# Altium schematic sheet Main.SchDoc: Earpiece mainboard
size A; DocumentNumber: 1; SheetNumber: 1; SheetTotal: 1
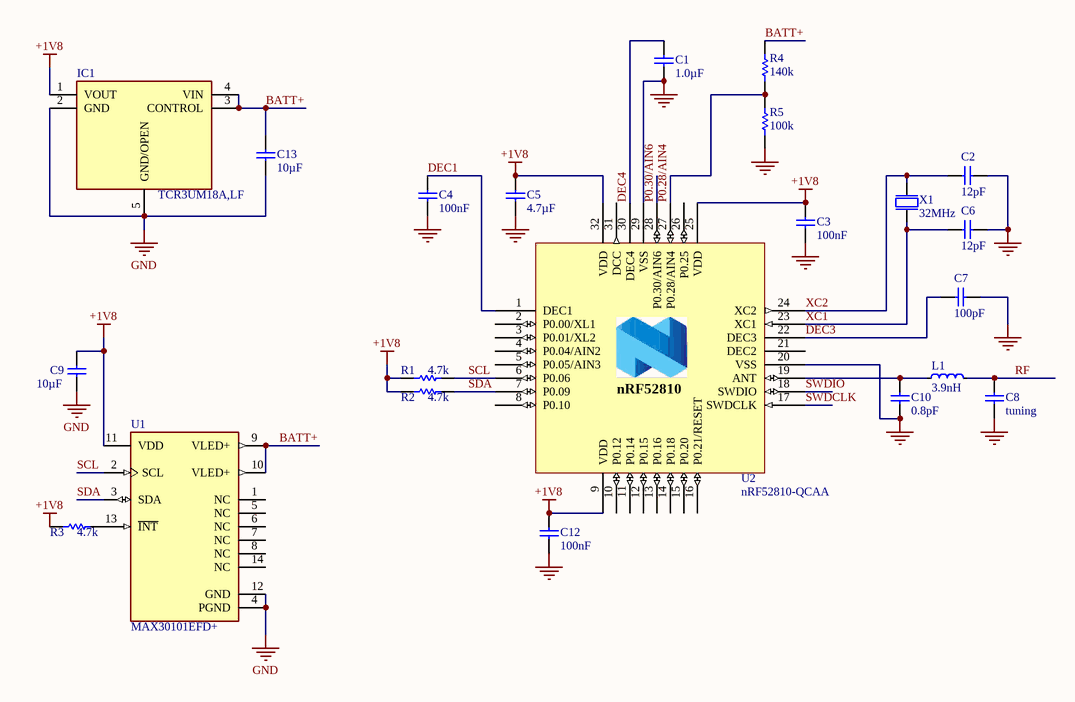
[diagram p0: Main.SchDoc]

## Parts
C1  1.0µF  [CAPC1005X04L]
C2  12pF  [CAPC1005X04L]
C3  100nF  [CAPC1005X04L]
C4  100nF  [CAPC1005X04L]
C5  4.7µF  [CAPC1005X04L]
C6  12pF  [CAPC1005X04L]
C7  100pF  [CAPC1005X04L]
C8  tuning  [CAPC1608X06L]
C9  10µF  [CAPC1005X04L]
C10  0.8pF  [CAPC1005X04L]
C12  100nF  [CAPC1005X04L]
C13  10µF  [CAPC1005X04L]
IC1  TCR3UM18A,LF  [TCR3UM18ALF]
L1  3.9nH  [INDC1005X04L]
R1  4.7k  [RESC0603X28X15NL05T05]
R2  4.7k  [RESC0603X28X15NL05T05]
R3  4.7k  [RESC0603X28X15NL05T05]
R4  140k  [RESC0603X28X15NL05T05]
R5  100k  [RESC0603X28X15NL05T05]
U1  MAX30101EFD+  [FP-F143A5-1-MFG]
U2  nRF52810-QCAA  [Nordic_QFN50P500X500X90-33N]
X1  32MHz  [BT-XTAL_2016]

## Nets
+1V8: C3.1 C5.1 C9.1 C12.1 IC1.1(VOUT) R1.1 R2.2 R3.2 U1.11(VDD) U2.9(VDD) U2.25(VDD) U2.32(VDD)
GND: C1.1 C2.2 C3.2 C4.2 C5.2 C6.2 C7.2 C8.1 C9.2 C10.1 C12.2 C13.1 IC1.2(GND) IC1.5(GND/OPEN) R5.2 U1.4(PGND) U1.12(GND) U2.20(VSS) U2.29(VSS) U2.33 X1.2(GND) X1.4(GND)
BATT+: C13.2 IC1.3(CONTROL) IC1.4(VIN) R4.1 U1.9(VLED+) U1.10(VLED+)
DEC1: C4.1 U2.1(DEC1)
DEC3: C7.1 U2.22(DEC3)
DEC4: C1.2 U2.30(DEC4)
P0.28/AIN4: R4.2 R5.1 U2.27(P0.28/AIN4)
P0.30/AIN6: U2.28(P0.30/AIN6)
RF: C8.2 L1.2
SCL: R1.2 U1.2(SCL) U2.6(P0.06)
SDA: R2.1 U1.3(SDA) U2.7(P0.09)
SWDCLK: U2.17(SWDCLK)
SWDIO: U2.18(SWDIO)
XC1: C6.1 U2.23(XC1) X1.1(inp)
XC2: C2.1 U2.24(XC2) X1.3(out)
NetC10_2: C10.2 L1.1 U2.19(ANT)
NetR3_1: R3.1 U1.13(~{INT})

Not connected (* = marked no-connect by the designer): U1 1(NC) 5(NC) 6(NC) 7(NC) 8(NC) 14(NC); U2 2(P0.00/XL1) 3(P0.01/XL2) 4(P0.04/AIN2) 5(P0.05/AIN3) 8(P0.10) 10(P0.12) 11(P0.14) 12(P0.15) 13(P0.16) 14(P0.18) 15(P0.20) 16(P0.21/RESET) 21(DEC2) 26(P0.25) 31(DCC)

## Notes on the sheet
- (in symbol nRF52810-QCAA) nRF52810

## Library data of the parts
C1 C9 C13 = C0603-1µ0: Capacitor, X7R, ±10%; Note: 16V; Part Number: C0603-1µ0; LatestRevisionDate: 2013-06-05; Pin Count: 2; Publisher: Nordic Semiconductor; Published: 2009-05-08; Footprint Doc: 0603; Manufacturer: *; Manufacturer Part Number: *
  C1: Value: 1.0µF
  C9 C13: Value: 10µF
C2 C6 = C0402-12p: Capacitor, NP0, ±2%; Note: 50V; Part Number: C0402-12p; LatestRevisionDate: 2011-05-11; Pin Count: 2; Publisher: Nordic Semiconductor; Published: 2009-05-08; Value: 12pF; Footprint Doc: 0402; Manufacturer: *; Manufacturer Part Number: *
C3 C4 C12 = C0402-100n: Capacitor, X7R, ±10%; Note: 16V; Part Number: C0402-100n; LatestRevisionDate: 2009-11-23; Pin Count: 2; Publisher: Nordic Semiconductor; Published: 2009-05-08; Value: 100nF; Footprint Doc: 0402; Manufacturer: *; Manufacturer Part Number: *
C5 = C0603-4µ7: Capacitor, X5R, ±10%; Note: 6.3V; Part Number: C0603-4µ7; LatestRevisionDate: 2009-11-23; Pin Count: 2; Publisher: Nordic Semiconductor; Published: 2009-05-08; Value: 4.7µF; Footprint Doc: 0603; Manufacturer: *; Manufacturer Part Number: *
C7 = C0402-100p: Capacitor, NP0, ±5%; Note: 50V; Part Number: C0402-100p; LatestRevisionDate: 2009-05-08; Pin Count: 2; Publisher: Nordic Semiconductor; Published: 2009-05-08; Value: 100pF; Footprint Doc: 0402; Manufacturer: *; Manufacturer Part Number: *
C8 C10 = C0402-0.8p: Capacitor, NP0, ±5%; Note: 50V; Part Number: C0402-0.8p; LatestRevisionDate: 2012-11-21; Pin Count: 2; Publisher: Nordic Semiconductor; Published: 2009-05-08; Footprint Doc: 0402; Manufacturer: *; Manufacturer Part Number: *
  C8: Value: tuning
  C10: Value: 0.8pF
IC1 = TCR3UM18A,LF: Integrated Circuit; Manufacturer_Name: Toshiba; Datasheet Link: https://toshiba.semicon-storage.com/info/docget.jsp?did=63293&prodName=TCR3UM18A; Manufacturer_Part_Number: TCR3UM18A,LF; Mouser Part Number: 757-TCR3UM18ALF; Mouser Price/Stock: https://www.mouser.co.uk/ProductDetail/Toshiba/TCR3UM18ALF/?qs=byeeYqUIh0P0oLl%2FDXjLWg%3D%3D; Arrow Part Number: TCR3UM18A,LF; Arrow Price/Stock: https://www.arrow.com/en/products/tcr3um18alf/toshiba
L1 = L0402-3n9: High frequency chip inductor ±5%; Part Number: L0402-3n9; LatestRevisionDate: 2012-09-19; Pin Count: 2; Publisher: Nordic Semiconductor; Published: 2009-05-08; Value: 3.9nH; Footprint Doc: 0402
R1-R5 = CMP-2004-00673-1: Part Number: CRCW02014K70JNED; Manufacturer: Vishay Dale
U1 = CMP-05738-000001-1: INTEGRATED OPTICAL SENSOR; Manufacturer: Maxim Integrated; Max Supply Voltage: 2V; Max Junction Temp: +90°C; Operating Supply Current: 600uA; Min Supply Voltage: 1.7V; Sensor Output: I2C; RoHS: TRUE; Footprint Url: https://pdfserv.maximintegrated.com/land_patterns/90-0602.PDF; Manufacturer Part Number: MAX30101EFD+; Device Class L2: unset; Temperature Range Low: -40°C; Automotive: No; Height: 1.65mm; Temperature Range High: +85°C; ComponentLink2Description: Datasheet; Mouser Description: INTEGRATED OPTICAL SENSOR; ComponentLink2URL: https://datasheets.maximintegrated.com/en/ds/MAX30101.pdf; Octopart: https://octopart.com/max30101efd%2B-maxim+integrated-57054333; Temperature: -40°C to +85°C; Package: F143A5-1; Lead Free: Yes; Device Class L1: Sensors; Digikey Description: INTEGRATED OPTICAL SENSOR; Category: IC; Device Class L3: unset
U2 = nRF52810-QCAA: Multi-protocol Bluetooth Low Energy, ANT and 2.4GHz proprietary system-on-chip; Manufacturer: Nordic Semiconductor; Note: nRF52810 - QFN32 5x5 0.5mm pitch; Part Number: nRF52810-QCAA; LatestRevisionDate: 2017-08-21; Pin Count: 32; Publisher: Nordic Semiconductor; Published: 2017-08-21; Value: nRF52810-QCAA; Footprint Doc: QFN-32; Manufacturer Part Number: nRF52810-QCAA
X1 = XTAL_SMD2016_32MHz_8pF_General: XTAL SMD 2016, 32MHz, Cl=8pF, Total Tol: ±40ppm; Part Number: XTAL_SMD2016_32MHz_8pF_General; LatestRevisionDate: 2016-08-19; Pin Count: 4; Publisher: Nordic Semiconductor; Published: 2016-08-19; Value: 32MHz; Footprint Doc: XTAL_2016; Manufacturer: *; Manufacturer Part Number: *